# EAGLE design H01R01 (EAGLE 9.6.2)

## Sheet 1 of 2
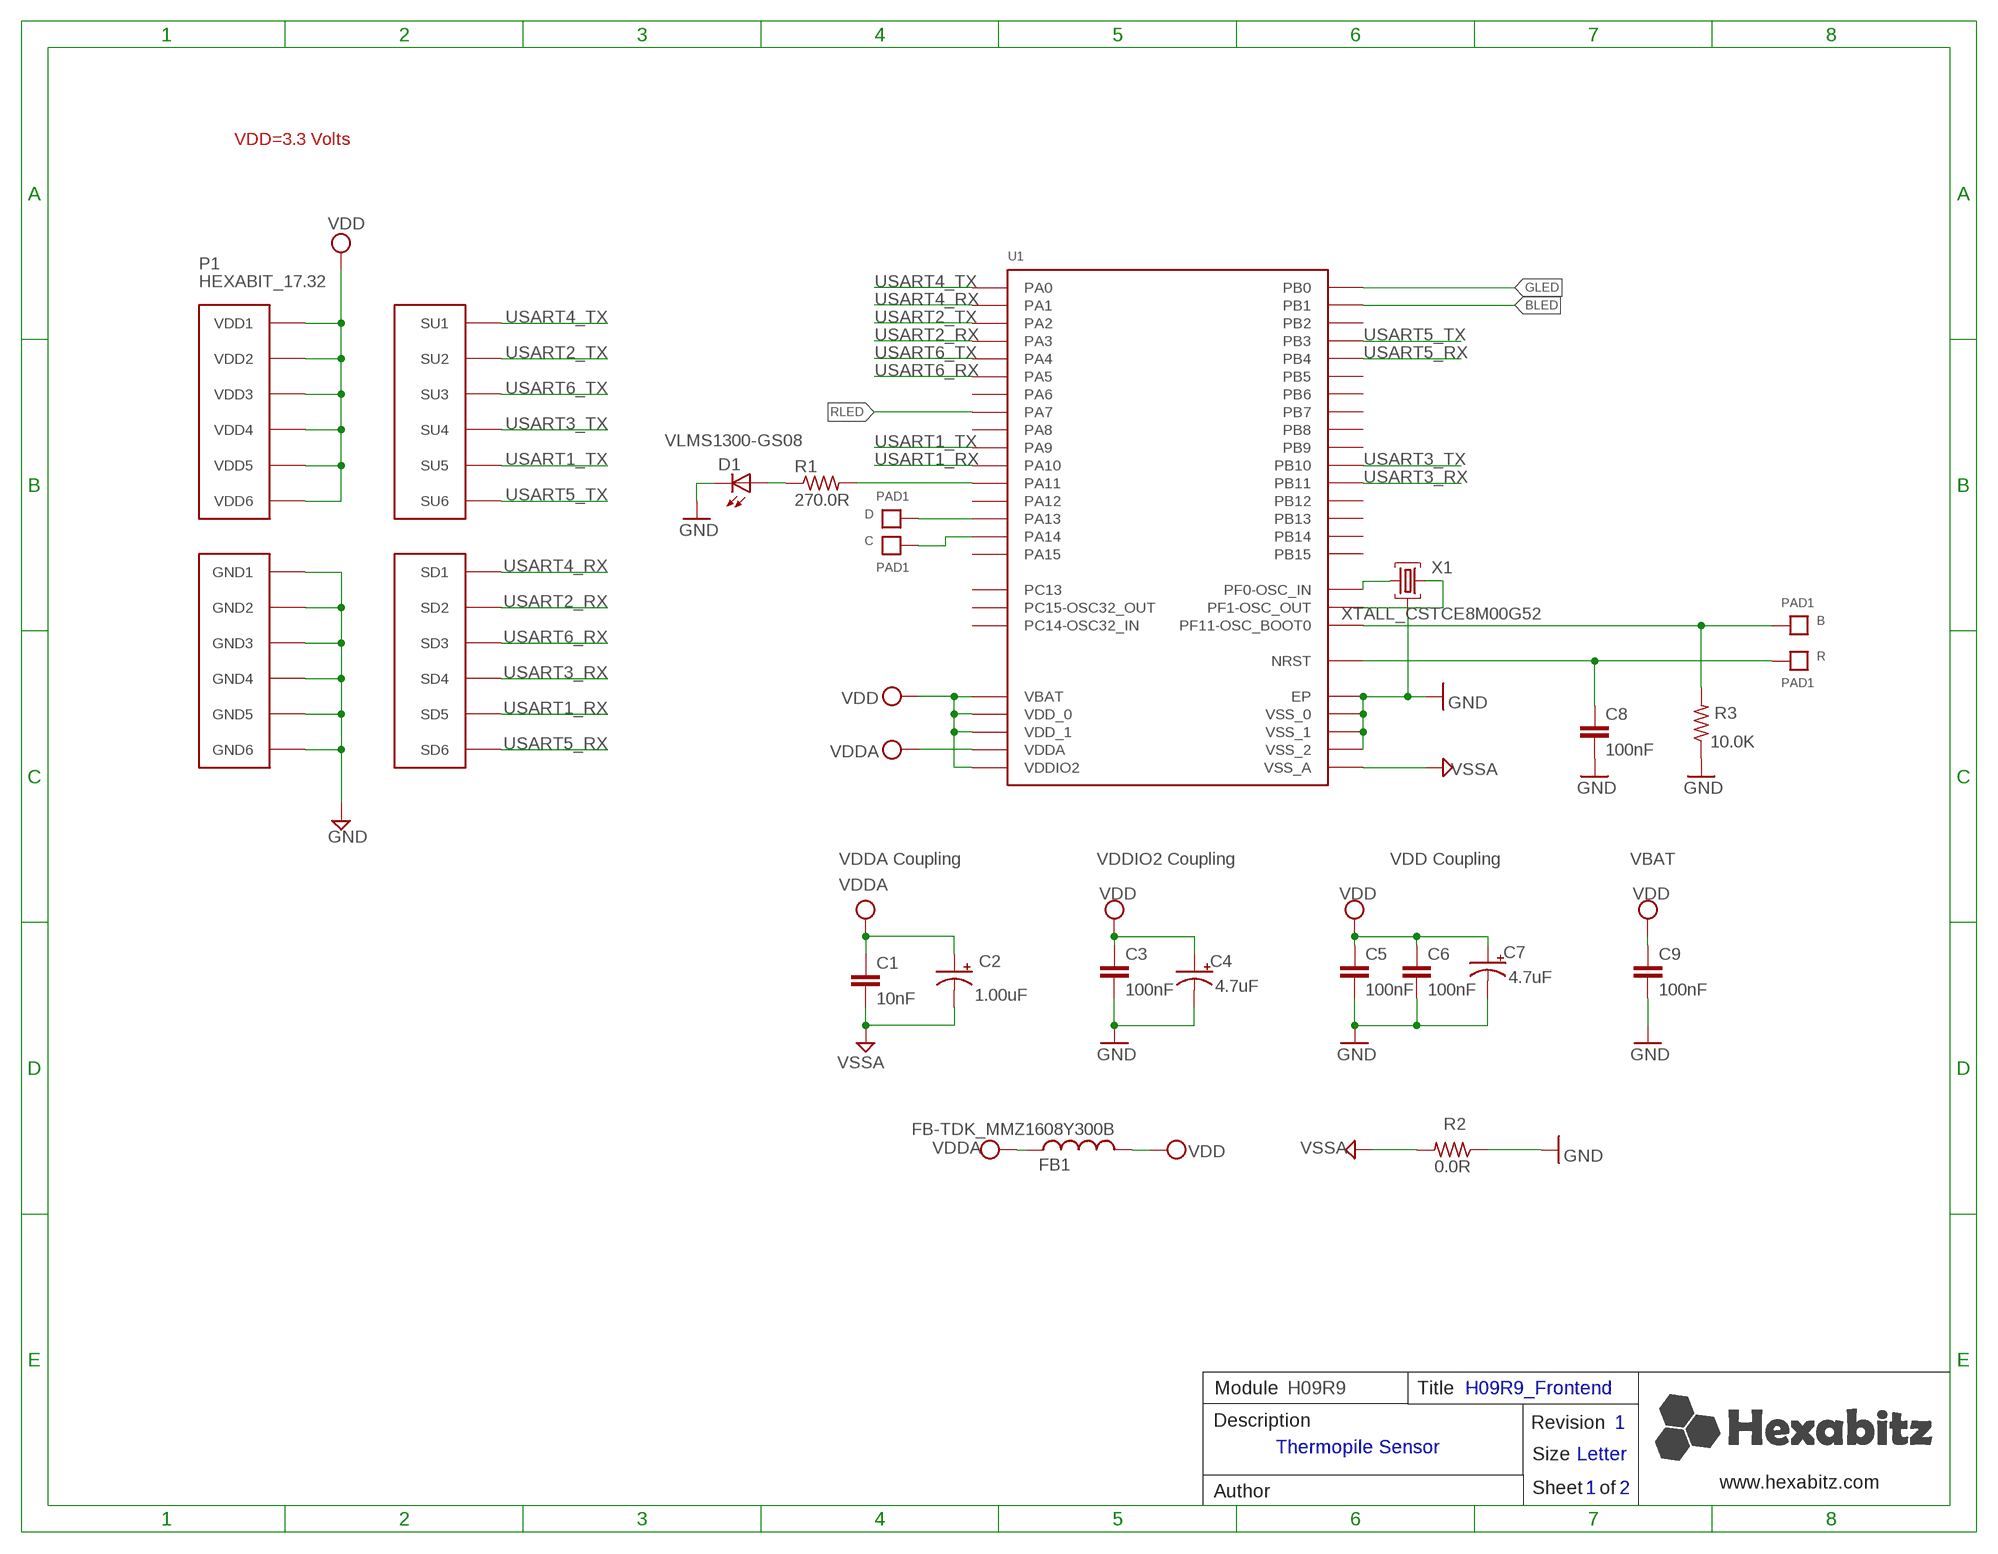
[diagram p0: schematic, sheet 1]

### Parts
B  PAD1  [PAD1]
C  PAD1  [PAD1]
C1  10nF  C-0603  [C-0603]
C2  1.00uF  C-0805-POL  [C-0805-POL]
C3  100nF  C-0603  [C-0603]
C4  4.7uF  C-0805-POL  [C-0805-POL]
C5  100nF  C-0603  [C-0603]
C6  100nF  C-0603  [C-0603]
C7  4.7uF  C-0805-POL  [C-0805-POL]
C8  100nF  C-0603  [C-0603]
C9  100nF  C-0603  [C-0603]
D  PAD1  [PAD1]
D1  VLMS1300-GS08  [VLMS1300-GS08]
FB1  FB-TDK_MMZ1608Y300B  [FB-TDK_MMZ1608Y300B]
P1  HEXABIT_17.32  [HEXABIT_17.32]
R  PAD1  [PAD1]
R1  270.0R  R-0603  [R-0603]
R2  0.0R  R-0603  [R-0603]
R3  10.0K  R-0603  [R-0603]
U1  STM32F091CBU6  [STM32F091CBU6]
X1  XTALL_CSTCE8M00G52  [XTALL_CSTCE8M00G52]

### Nets
B1: B.P$1 B.P$2 R3.2 U1.P$44(PF11-OSC_BOOT0)
BLED: U1.P$19(PB1)
GLED: U1.P$18(PB0)
GND: C3.2 C4.2(-) C5.2 C6.2 C7.2(-) C8.2 C9.2 D1.C P1.PAD_PD7(GND1) P1.PAD_PD8(GND2) P1.PAD_PD9(GND3) P1.PAD_PD10(GND4) P1.PAD_PD11(GND5) P1.PAD_PD12(GND6) R2.1 R3.1 U1.EP U1.P$23(VSS_0) U1.P$35(VSS_1) U1.P$47(VSS_2) X1.P$2 ; also sheet 2
N$3: R1.2 U1.P$32(PA11)
N$4: D1.A R1.1
N$5: U1.P$5(PF0-OSC_IN) X1.P$1
N$6: U1.P$6(PF1-OSC_OUT) X1.P$3
N$7: D.P$1 D.P$2 U1.P$34(PA13)
N$9: C.P$1 C.P$2 U1.P$37(PA14)
R1: C8.1 R.P$1 R.P$2 U1.P$7(NRST)
RLED: U1.P$17(PA7)
USART1_RX: P1.PAD_PD5(SD5) U1.P$31(PA10)
USART1_TX: P1.PAD_PU5(SU5) U1.P$30(PA9)
USART2_RX: P1.PAD_PD2(SD2) U1.P$13(PA3)
USART2_TX: P1.PAD_PU2(SU2) U1.P$12(PA2)
USART3_RX: P1.PAD_PD4(SD4) U1.P$22(PB11)
USART3_TX: P1.PAD_PU4(SU4) U1.P$21(PB10)
USART4_RX: P1.PAD_PD1(SD1) U1.P$11(PA1)
USART4_TX: P1.PAD_PU1(SU1) U1.P$10(PA0)
USART5_RX: P1.PAD_PD6(SD6) U1.P$40(PB4)
USART5_TX: P1.PAD_PU6(SU6) U1.P$39(PB3)
USART6_RX: P1.PAD_PD3(SD3) U1.P$15(PA5)
USART6_TX: P1.PAD_PU3(SU3) U1.P$14(PA4)
VDD: C3.1 C4.1(+) C5.1 C6.1 C7.1(+) C9.1 FB1.2 P1.PAD_PU7(VDD1) P1.PAD_PU8(VDD2) P1.PAD_PU9(VDD3) P1.PAD_PU10(VDD4) P1.PAD_PU11(VDD5) P1.PAD_PU12(VDD6) U1.P$1(VBAT) U1.P$24(VDD_0) U1.P$36(VDDIO2) U1.P$48(VDD_1)
VDDA: C1.1 C2.1(+) FB1.1 U1.P$9(VDDA)
VSSA: C1.2 C2.2(-) R2.2 U1.P$8(VSS_A)
Unconnected: U1.P$2(PC13) U1.P$3(PC14-OSC32_IN) U1.P$4(PC15-OSC32_OUT) U1.P$16(PA6) U1.P$20(PB2) U1.P$25(PB12) U1.P$26(PB13) U1.P$27(PB14) U1.P$28(PB15) U1.P$29(PA8) U1.P$33(PA12) U1.P$38(PA15) U1.P$41(PB5) U1.P$42(PB6) U1.P$43(PB7) U1.P$45(PB8) U1.P$46(PB9)

### Notes on the sheet
- VDD=3.3 Volts
- VDDA Coupling | VDDIO2 Coupling | VDD Coupling | VBAT
- Module | H09R9 | Title | H09R9_Frontend
- Description | Revision | 1
- Thermopile Sensor
- Size | Letter
- www.hexabitz.com
- Author | Sheet   of | 1 | 2
- C:/Users/Admin/Desktop/logodraft.bmp

## Sheet 2 of 2
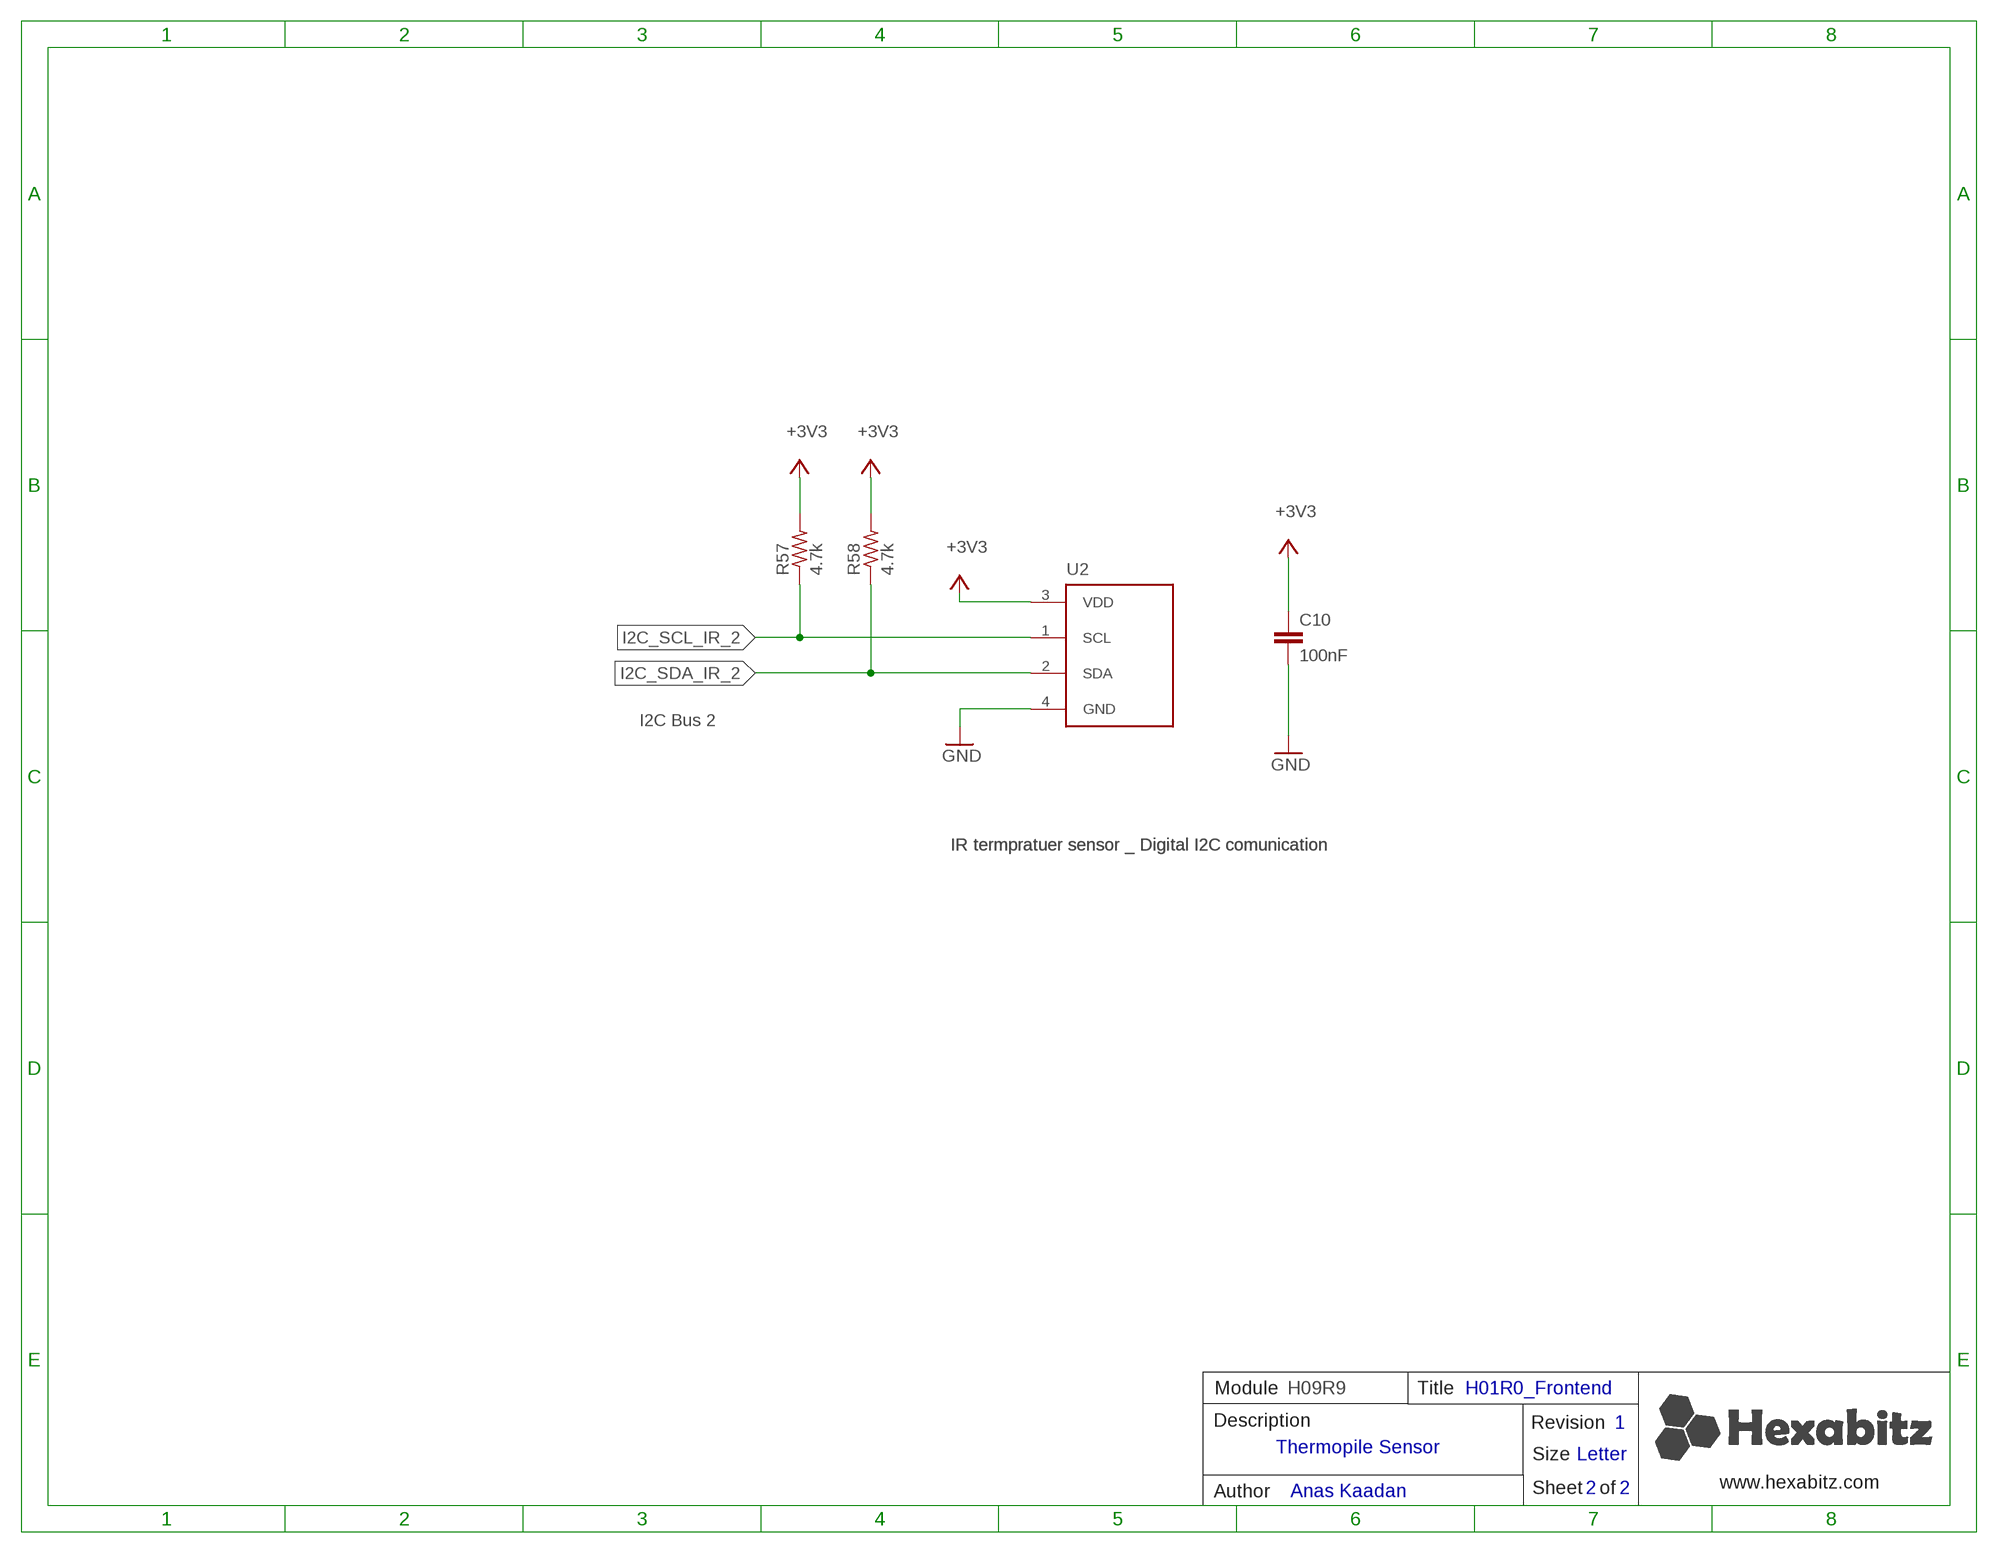
[diagram p1: schematic, sheet 2]

### Parts
C10  100nF  C-0603  [C-0603]
R57  4.7k  R-0603  [R-0603]
R58  4.7k  R-0603  [R-0603]
U2  TSD305-1C55  [TEMPERATURESENSOR-TO5]

### Nets
+3V3: C10.1 R57.2 R58.2 U2.3(VDD)
GND: C10.2 U2.4(GND) ; also sheet 1
I2C_SCL_IR_2: R57.1 U2.1(SCL)
I2C_SDA_IR_2: R58.1 U2.2(SDA)

### Notes on the sheet
- I2C Bus 2
- IR termpratuer sensor _ Digital I2C comunication | IR termpratuer sensor _ Digital I2C comunication
- Module | H09R9 | Title | H01R0_Frontend
- Description | Revision | 1
- Thermopile Sensor
- Size | Letter
- www.hexabitz.com
- Author | Anas Kaadan | Sheet   of | 2 | 2

## Library data of the parts
B C D R = Hexabitz:PAD1
C1 = Hexabitz:C-0603: CAP CER 10% X7R 0603; CAPACITANCE: 10nF; MFN: KEMET; MPN: C0603C103K5RACTU; OCTOPART_URL: https://octopart.com/c0603c103k5ractu-kemet-133094?r=sp&s=R_iPBxLnSmGqhkU2rIMFpg; TOLERANCE: 10%; VOLTAGE_RATING: 50V
C2 = Hexabitz:C-0805-POL: Cap Tant Solid SMD 2012; CAPACITANCE: 1.00uF; MFN: Yageo; MPN: CC0805KKX7R7BB105; OCTOPART_URL: https://octopart.com/cc0805kkx7r7bb105-yageo-8376555?r=sp&s=YKl1wwtkROau_X5nniH2ig; TOLERANCE: 10%; VOLTAGE_RATING: 16V
C3 C6 C8 = Hexabitz:C-0603: CAP CER 10% X7R 0603; CAPACITANCE: 100nF; MFN: KEMET; MPN: C0603C104K8RACTU; OCTOPART_URL: https://octopart.com/c0603c104k8ractu-kemet-145075?r=sp&s=9bS9ASSwSEqMCE9KBEQZ0g; TOLERANCE: 10%; VOLTAGE_RATING: 10V
C4 C7 = Hexabitz:C-0805-POL: Cap Tant Solid SMD 2012; CAPACITANCE: 4.7uF; MFN: Murata; MPN: GRM21BC81E475KA12L; OCTOPART_URL: https://octopart.com/grm21bc81e475ka12l-murata-10331911?r=sp&s=RY3qZSD8T6mG6TC9CHI5qQ; TOLERANCE: 10%; VOLTAGE_RATING: 25V
C5 = Hexabitz:C-0603: CAP CER 10% X7R 0603; CAPACITANCE: 100nF; MFN: KEMET; MPN: C0603C104K8RACTU; OCTOPART_URL: https://octopart.com/c0603c104k8ractu-kemet-145075?r=sp&s=9bS9ASSwSEqMCE9KBEQZ0g; TOLERANCE: 10%; VOLTAGE_RATING: 10
C9 = Hexabitz:C-0603: CAP CER 10% X7R 0603; CAPACITANCE: 100nF; MFN: KEMET; MPN: C0603C104K8RACTU; OCTOPART_URL: https://octopart.com/c0603c104k8ractu-kemet-145075?r=sp&s=9bS9ASSwSEqMCE9KBEQZ0g; TOLERANCE: 10V; VOLTAGE_RATING: 10%
C10 = HEXABITZ_RCLS:C-0603: CAP CER 10% X7R 0603; CAPACITANCE: 100nF; MFN: KEMET; MPN: C0603C104K8RACTU; OCTOPART_URL: https://octopart.com/c0603c104k8ractu-kemet-145075?r=sp&s=9bS9ASSwSEqMCE9KBEQZ0g; TOLERANCE: 10%; VOLTAGE_RATING: 10V
D1 = Hexabitz:VLMS1300-GS08: Red 0603 130° Clear 54 mcd 2 V Surface Mount ChipLED ; Octopart Url : http://octopart.com/vlms1300-gs08-vishay-21709201; MFN: Vishay; MPN: VLMS1300-GS08; OCTOPART_URL: https://octopart.com/vlms1300-gs08-vishay-21709201?r=sp&s=_gcP4_q8T1SC6PJQPTQ9yA
FB1 = Hexabitz:FB-TDK_MMZ1608Y300B: Ferrite Beads Multi-Layer 30Ohm 25% 100MHz 1.5A 50mOhm DCR 0603; MFN: TDK; MPN: MMZ1608Y300B; OCTOPART_URL: https://octopart.com/mmz1608y300b-tdk-368280?r=sp&s=cd9_2ZEqQ9q9UNBuQgHAiA
P1 = hexabitz_connectors:HEXABIT_?: Hexabitz Hexagon Module Connector Hexagon side length = 17.32mm.
R1 = Hexabitz:R-0603: Thick Film Resistors - SMD 0603; MFN: Yageo; MPN: RC0603FR-07270RL; OCTOPART_URL: https://octopart.com/search?q=RC0603FR-07270RL&start=0; RESISTANCE: 270.0 Ohm; TOLERANCE: 5%
R2 = Hexabitz:R-0603: Thick Film Resistors - SMD 0603; MFN: Yageo; MPN: RC0603JR-070RL; OCTOPART_URL: https://octopart.com/rc0603jr-070rl-yageo-1241539?r=sp&s=X2NteqRjRNWrnx42Y0aliA; RESISTANCE: 0.0 Ohm
R3 = Hexabitz:R-0603: Thick Film Resistors - SMD 0603; MFN: Yageo; MPN: RC0603JR-0710KL; OCTOPART_URL: https://octopart.com/search?q=RC0603JR-0710KL&start=0; RESISTANCE: 10.0K Ohm; TOLERANCE: 5%
R57 R58 = HEXABITZ_RCLS:R-0603: Thick Film Resistors - SMD 0603; MFN: Yageo; MPN: RC0603FR-07270RL; OCTOPART_URL: https://octopart.com/crcw06032k20fkea-vishay-40018987; RESISTANCE: 2.2 kΩ; TOLERANCE: ±1%
U1 = Hexabitz:STM32F091CBU6: Description : ARM-based 32-bit MCU, CAN, 12 timers, ADC, DAC & Comm. Interface, 2 to 3.6 V, -40 to 85 degC, 48-Pin UFQFPN, RoHS, Tray ;Parameter : Ciiva URL : https://ciiva.com/part/STM32F091CBU6-20240708, CiivaID : 20240708, Clock Speed : 48000000.0 Hz, Lifecycle Status : Active, Mounting Style : Surface Mount, Number of Pins : 48, Octopart Url : https://octopart.com/stm32f091cbu6-stmicroelectronics-51988677, OctopartID : 5f4f955c32ec8088, RAM Memory Size : 32768 B, REACH SVHC Compliance : No SVHC, RoHS : Compliant,; MFN: STMicroelectronics; MPN: STM32F091CBU6; OCTOPART_URL: https://octopart.com/stm32f091cbu6-stmicroelectronics-51988677?r=sp&s=bU6fpgsrTZOxHyt7jkfh3w
U2 = HEXABITZ_ICs:TSD305-1C55: I2C DIGITAL THERMOPILE SENSOR; MFN: TE Connectivity; MPN: G-TPMO-101; OCTOPART_URL: https://octopart.com/g-tpmo-101-te+connectivity-76900424?r=sp
X1 = Hexabitz:XTALL_CSTCE8M00G52: MURATA CSTCE8M00G52-R0 RESONATOR, SMD, 8MHZ ; Octopart Url : https://octopart.com/cstce8m00g52-r0-murata-7145559; MFN: Murata; MPN: CSTCE8M00G52Z-R0; OCTOPART_URL: https://octopart.com/cstce8m00g52z-r0-murata-17755941?r=sp&s=JDnNJnrHQhyS8Zk4ofFWXw

## Board
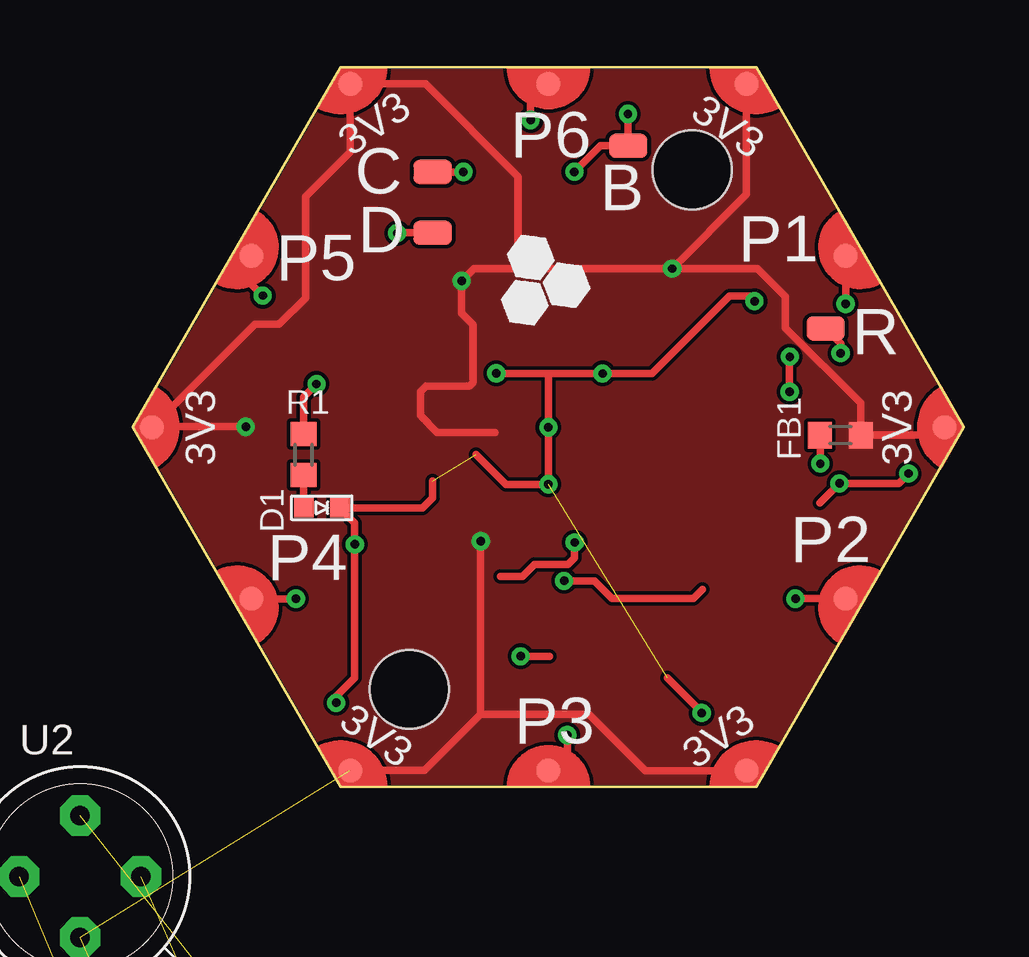
[diagram p2: board, top side]
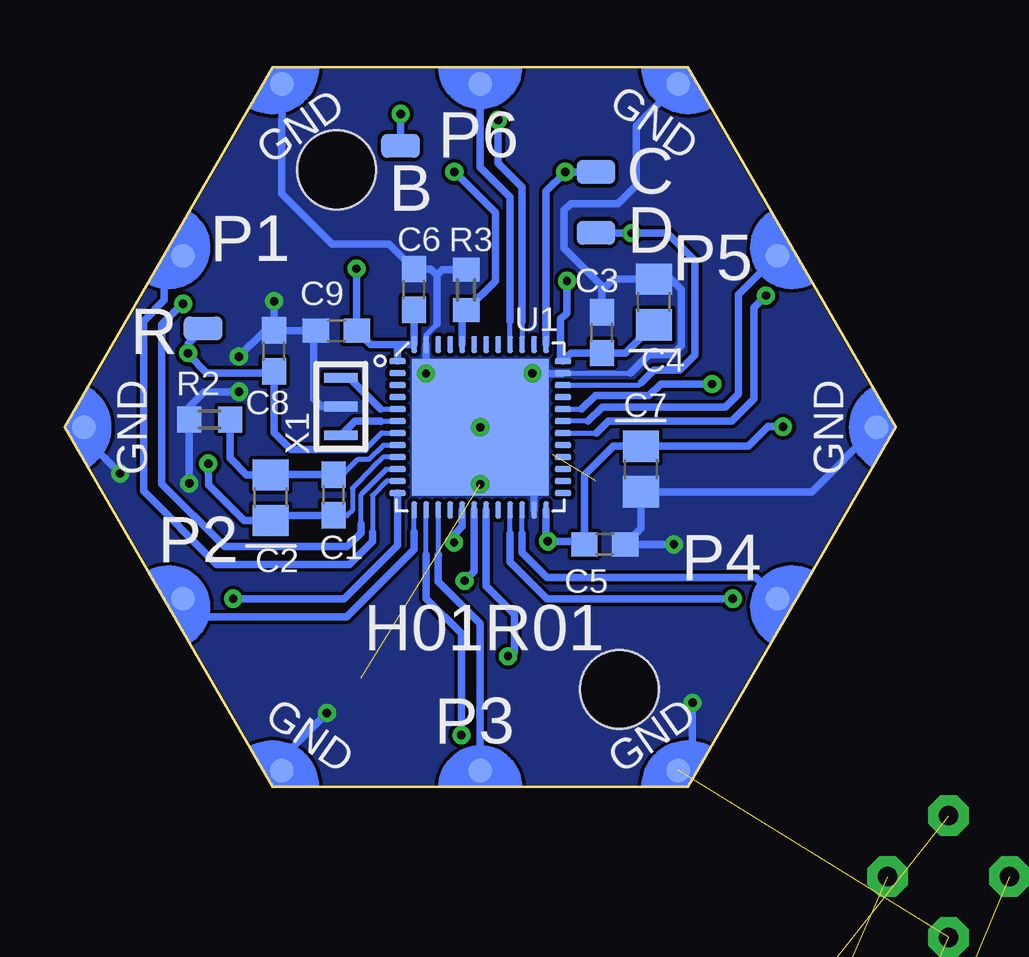
[diagram p3: board, bottom side, seen from below]

Size 34.64 x 30 mm. Coordinates in mm from the lower left corner, seen from the top.
Copper layers (1*16): Top 0.035mm / dielectric 1.5mm / Bottom 0.035mm
Design rules "2_layer *": minimum track width 7mil, minimum drill 10mil, track to track 6mil, track to pad 6mil, pad to pad 6mil, via to via 6mil, smd to smd 0mil, copper to edge 1mil, drill to drill 8mil, minimum pad ring 10mil, minimum via ring 8mil, stop-mask expansion 2mil, vias tented up to drill 15mil, thermal gap 10mil
Holes 3.28 mm at 11.52,4.07 23.31,25.73

### Footprints (pad centres in the part's own frame; a part is rotated, then mirrored left to right if it is on the bottom)
PAD1 = smd 1.6 x 1: P$1 0,0 | smd 1.6 x 1 bottom: P$2 0,0
C-0603 = smd 1.1 x 1: 1 -0.85,0; 2 0.85,0
C-0805-POL = smd 1.3 x 1.5: 1 -0.95,0; 2 0.95,0
VLMS1300-GS08 = smd 0.8 x 0.8: A 0,0.75; C 0,-0.75
FB-TDK_MMZ1608Y300B = smd 1 x 1.1: 1 -0.85,0; 2 0.85,0
HEXABIT_17.32 = smd 1 x 1 bottom: PAD_PD1 12.39,7.15; PAD_PD2 12.39,-7.15; PAD_PD3 0,-14.31; PAD_PD4 -12.39,-7.15; PAD_PD5 -12.39,7.15; PAD_PD6 0,14.31; PAD_PD7 8.26,14.31; PAD_PD8 16.52,0; PAD_PD9 8.26,-14.31; PAD_PD10 -8.26,-14.31; PAD_PD11 -16.52,0; PAD_PD12 -8.26,14.31 | smd 1 x 1: PAD_PU1 12.39,7.15; PAD_PU2 12.39,-7.15; PAD_PU3 0,-14.31; PAD_PU4 -12.39,-7.15; PAD_PU5 -12.39,7.15; PAD_PU6 0,14.31; PAD_PU7 8.26,14.31; PAD_PU8 16.52,0; PAD_PU9 8.26,-14.31; PAD_PU10 -8.26,-14.31; PAD_PU11 -16.52,0; PAD_PU12 -8.26,14.31
R-0603 = smd 1 x 1.1: 1 -0.85,0; 2 0.85,0
STM32F091CBU6 = smd 5.7 x 5.7: EP 0,0 | smd 0.25 x 0.7: P$1 -2.75,-3.45; P$2 -2.25,-3.45; P$3 -1.75,-3.45; P$4 -1.25,-3.45; P$5 -0.75,-3.45; P$6 -0.25,-3.45; P$7 0.25,-3.45; P$8 0.75,-3.45; P$9 1.25,-3.45; P$10 1.75,-3.45; P$11 2.25,-3.45; P$12 2.75,-3.45; P$25 2.75,3.45; P$26 2.25,3.45; P$27 1.75,3.45; P$28 1.25,3.45; P$29 0.75,3.45; P$30 0.25,3.45; P$31 -0.25,3.45; P$32 -0.75,3.45; P$33 -1.25,3.45; P$34 -1.75,3.45; P$35 -2.25,3.45; P$36 -2.75,3.45 | smd 0.7 x 0.25: P$13 3.45,-2.75; P$14 3.45,-2.25; P$15 3.45,-1.75; P$16 3.45,-1.25; P$17 3.45,-0.75; P$18 3.45,-0.25; P$19 3.45,0.25; P$20 3.45,0.75; P$21 3.45,1.25; P$22 3.45,1.75; P$23 3.45,2.25; P$24 3.45,2.75; P$37 -3.45,2.75; P$38 -3.45,2.25; P$39 -3.45,1.75; P$40 -3.45,1.25; P$41 -3.45,0.75; P$42 -3.45,0.25; P$43 -3.45,-0.25; P$44 -3.45,-0.75; P$45 -3.45,-1.25; P$46 -3.45,-1.75; P$47 -3.45,-2.25; P$48 -3.45,-2.75
TEMPERATURESENSOR-TO5 = drill 0.813 pad 1.676 octagon: 1 2.54,0; 2 0,2.54; 3 -2.54,0; 4 0,-2.54
XTALL_CSTCE8M00G52 = smd 1.4 x 0.4: P$1 0,1.2; P$2 0,0; P$3 0,-1.2

### Placement (x,y rotation side)
B  20.65,26.73 0 top
C  12.49,25.64 0 top
C1  23.43,12.17 90 bottom
C2  26.06,12.06 90 bottom
C3  12.25,18.94 90 bottom
C4  10.09,20.22 90 bottom
C5  12.12,10.12 0 bottom
C6  20.09,20.74 90 bottom
C7  10.62,13.26 270 bottom
C8  25.91,18.18 90 bottom
C9  23.32,19.03 180 bottom
C10  1.45,-16.55 0 top  (outside the outline)
D  12.49,23.1 180 top
D1  7.87,11.64 90 top
FB1  29.49,14.67 0 top
P1  17.32,15 0 top
R  28.88,19.11 0 top
R1  7.11,13.86 90 top
R2  28.6,15.32 0 bottom
R3  17.91,20.73 270 bottom
R57  6.79,-16.55 0 top  (outside the outline)
R58  10.75,-16.55 0 top  (outside the outline)
U1  17.32,15 270 bottom
U2  -2.2,-3.73 0 top
X1  23.13,15.86 0 bottom

### Tracks (layer width: path | path; a pad name or v marks a point on that pad's centre or on a via)
+3V3  (3 unrouted)
B1  (via drill 0.35)
  Top 0.305: v20.63,28.06 20.63,26.75 | 20.63,26.75 B.P$1 | v18.4,25.65 19.5,26.75 20.63,26.75
  Bottom 0.305: B.P$1 20.65,28.04 v20.63,28.05 v20.63,28.06 | v18.4,25.65 16.69,23.94 16.69,21.09 R3.2 18.07,19.72 U1.P$44
BLED  (via drill 0.35)
  Top 0.305: v16.16,5.45 17.36,5.45
  Bottom 0.305: U1.P$19 17.07,8.38 15.89,7.2 15.89,5.61 16.05,5.45 v16.16,5.45
GLED  (via drill 0.35)
  Top 0.305: 23.74,8.23 23.37,7.86 19.97,7.86 19.23,8.6 19.23,8.59 v17.97,8.59
  Bottom 0.305: U1.P$18 17.57,8.99 v17.97,8.6 v17.97,8.59
GND  (via drill 0.35)  (4 unrouted)
  Top 0.305: 12.49,12.76 12.49,12.05 12.08,11.64 D1.C 9.25,11.02 v9.25,10.12 9.25,4.55 8.47,3.78 v8.47,3.51 | 17.32,17.25 U1.EP 17.32,12.68 17.33,12.68 v17.33,12.62 | 17.32,17.25 v15.14,17.25 | 17.32,17.25 19.56,17.25 | 19.56,17.25 | 19.56,17.25 v19.58,17.25 v19.58,17.24 21.64,17.24 24.86,20.46 25.71,20.46 v25.91,20.25 | v17.33,12.62 v17.32,12.62 | 14.3,13.87 15.55,12.61 v17.33,12.61 v17.33,12.62 | v27.37,16.48 v27.37,17.93 v27.38,17.94 | 28.64,11.84 v29.45,12.66 31.92,12.66 v32.33,13.07 | v32.33,13.07 | v23.71,3.09 23.71,3.12 22.28,4.55
  Bottom 0.203: U1.P$47 19.57,18.85 19.13,19.29 | U1.P$35 11.06,17.25 | C4.2 | 12.26,20.67 12.25,20.66
  Bottom 0.305: 19.13,19.29 19.13,21.34 | P1.PAD_PD7 25.58,27.82 25.59,27.81 25.59,24.73 23.49,22.63 21.13,22.63 C6.2 19.38,21.59 19.13,21.34 | U1.P$35 17.32,17.25 17.32,17.24 | 17.32,17.24 U1.EP v17.32,12.62 15.07,12.62 U1.P$23 | v19.57,17.24 17.32,17.24 | U1.P$47 v19.57,17.24 | v19.57,17.24 v19.58,17.24 | v27.37,16.48 v27.37,16.47 27.39,16.46 28.83,16.46 29.45,15.84 R2.1 29.45,12.69 29.44,12.69 v29.44,12.67 v29.45,12.66 | 11.06,17.25 10.28,18.03 9.31,18.03 8.93,18.4 8.93,20.74 9.36,21.16 C4.2 | C4.2 11.76,21.17 12.26,20.67 | 12.25,20.66 C3.2 12.25,20.89 13.82,22.47 13.82,24.04 13.53,24.33 11.58,24.33 10.81,25.1 10.81,27.56 P1.PAD_PD12 | P1.PAD_PD9 25.58,1.21 v23.71,3.09 | R3.1 18.89,21.58 19.13,21.34 | P1.PAD_PD11 3.49,12.31 C7.2 10.62,10.77 C5.2 v9.25,10.12 | X1.P$2 23.93,15.86 24.26,16.19 24.26,18.93 C9.2 C8.2 | C8.2 v25.91,20.25 | v27.38,17.94 26.3,19.03 C8.2 | v32.33,13.07 33.84,14.57 P1.PAD_PD8 | v8.47,3.51 8.47,1.28 P1.PAD_PD10
  other vias: 17.32,15
  pour Bottom (no thermals): 8.66,0 25.98,0 34.64,15 25.98,30 8.66,30 0,15
I2C_SCL_IR_2  (1 unrouted)
I2C_SDA_IR_2  (1 unrouted)
N$3  (via drill 0.35)
  Top 0.305: v7.65,16.8 7.11,16.26 R1.2
  Bottom 0.203: U1.P$32 13.09,15.75
  Bottom 0.305: 13.09,15.75 12.52,16.31 10.28,16.31 9.79,16.8 v7.66,16.8 v7.65,16.8
N$4
  Top 0.305: R1.1 D1.A
N$5
  Bottom 0.203: 21.47,15.75 U1.P$5
  Bottom 0.305: X1.P$1 22.78,17.06 21.47,15.75
N$6
  Bottom 0.203: 21.47,15.24 21.46,15.25 U1.P$6
  Bottom 0.305: X1.P$3 22.54,15.25 21.48,15.25 21.47,15.24
N$7  (via drill 0.35)
  Top 0.305: D.P$1 11.03,23.1 v11.02,23.09
  Bottom 0.203: U1.P$34 10.71,16.75 10.6,16.86
  Bottom 0.305: 10.6,16.86 10.07,17.39 8.99,17.39 8.36,18.01 8.36,21.94 9.52,23.09 v11.02,23.09 D.P$1
N$9  (via drill 0.35)
  Top 0.305: C.P$1 v13.77,25.64 v13.78,25.64
  Bottom 0.305: U1.P$37 14.57,24.85 v13.78,25.64 C.P$1
R1  (via drill 0.35)
  Top 0.305: v29.5,18.09 29.5,18.49 R.P$1
  Bottom 0.203: U1.P$7 21.43,14.76 22.11,14.07
  Bottom 0.305: 22.11,14.07 25.21,14.07 25.91,14.77 C8.1 25.99,17.25 28.72,17.25 29.5,18.04 v29.5,18.09 29.5,18.49 R.P$1
RLED  (via drill 0.35)
  Top 0.305: 15.33,8.79 16.24,8.79 16.74,9.29 18.14,9.29 18.41,9.56 18.41,10.12 | 18.41,10.12 | 18.41,10.12 v18.41,10.19
  Bottom 0.305: v18.41,10.19 18.41,10.51 18.07,10.86 U1.P$17 | U1.P$17
USART1_RX
  Bottom 0.203: 12.83,15.25 U1.P$31
  Bottom 0.305: P1.PAD_PD5 6.55,20.53 6.55,16.39 7.09,15.85 12.23,15.85 12.83,15.25
USART1_TX  (via drill 0.35)
  Top 0.305: v5.41,20.48 4.93,20.96 P1.PAD_PU5
  Bottom 0.203: U1.P$30 12.47,14.75
  Bottom 0.305: 12.47,14.75 11.97,15.25 6.83,15.25 5.9,16.18 5.9,19.98 v5.4,20.48 v5.4,20.49 v5.41,20.49 v5.41,20.48
USART2_RX
  Bottom 0.203: 20.07,10.63 20.07,10.64 U1.P$13
  Bottom 0.305: P1.PAD_PD2 28.95,7.09 22.89,7.09 20.07,9.91 20.07,10.63
USART2_TX  (via drill 0.35)
  Top 0.305: v27.62,7.85 P1.PAD_PU2
  Bottom 0.305: U1.P$12 20.77,10.07 22.99,7.85 v27.62,7.85
USART3_RX
  Bottom 0.203: 15.57,10.56 U1.P$22 | U1.P$22
  Bottom 0.305: P1.PAD_PD4 5.83,8.74 14.53,8.74 15.57,9.78 15.57,10.56
USART3_TX  (via drill 0.35)
  Top 0.305: v6.79,7.85 P1.PAD_PU4 | P1.PAD_PU4
  Bottom 0.203: 16.07,10.57 U1.P$21
  Bottom 0.305: 16.07,10.57 16.08,10.56 16.08,9.38 14.55,7.85 v6.79,7.85
USART4_RX
  Bottom 0.203: U1.P$11 21.23,12.75 21.82,12.16 21.82,10.61
  Bottom 0.305: P1.PAD_PD1 30.49,21.37 30.49,20.3 31.36,19.43 31.36,12.34 28.3,9.28 22.77,9.28 21.82,10.24 21.82,10.61
USART4_TX  (via drill 0.35)
  Top 0.305: P1.PAD_PU1 29.62,22.06 29.71,21.97 v29.71,20.15
  Bottom 0.203: U1.P$10 21.23,13.25 22.29,12.19 22.29,10.96
  Bottom 0.305: v29.71,20.15 29.73,20.15 30.6,19.27 30.6,12.64 27.98,10.03 27.98,10.02 22.86,10.02 22.29,10.6 22.29,10.96
USART5_RX
  Bottom 0.203: 16.07,19.43 U1.P$40
  Bottom 0.305: 16.07,19.43 16.07,19.72 16.07,24.59 17.32,25.84 P1.PAD_PD6
USART5_TX  (via drill 0.35)
  Top 0.305: v16.58,27.81 16.58,28.57 P1.PAD_PU6
  Bottom 0.203: 15.58,19.41 U1.P$39
  Bottom 0.305: 15.58,19.41 15.57,19.42 15.57,25.01 16.58,26.02 v16.58,27.81
USART6_RX
  Bottom 0.203: 19.07,9.68 U1.P$15
  Bottom 0.305: P1.PAD_PD3 17.32,6.81 19.07,8.56 19.07,9.67 19.07,9.68
USART6_TX  (via drill 0.35)
  Top 0.305: v18.11,2.16 18.11,1.48 P1.PAD_PU3
  Bottom 0.203: 19.57,9.68 U1.P$14
  Bottom 0.305: 19.57,9.68 19.57,7.87 18.11,6.4 18.11,2.18 v18.11,2.16
VDD  (via drill 0.35)
  Top 0.305: 16.05,21.61 16.05,25.45 12.2,29.31 P1.PAD_PU12 9.06,26.47 7.2,24.61 7.2,20.39 6.1,19.29 5.09,19.29 P1.PAD_PU11 0.91,15.11 0.99,15.02 v4.7,15.02 | 15.09,14.78 12.69,14.78 11.98,15.48 11.98,16.48 12.22,16.72 14.03,16.72 14.18,16.87 14.18,19.28 13.7,19.75 v13.7,21.1 14.22,21.61 16.05,21.61 | v14.5,10.24 v14.49,10.24 14.49,3.03 | 16.05,21.61 22.46,21.61 v22.48,21.61 | v22.48,21.61 25.58,24.71 P1.PAD_PU7 | v22.48,21.61 26.02,21.61 27.2,20.43 27.2,19.14 30.34,16 FB1.2 33.51,14.67 P1.PAD_PU8 | P1.PAD_PU9 25.57,0.68 21.36,0.68 19.02,3.02 14.5,3.02 14.49,3.03 | 14.49,3.03 12.16,0.69 P1.PAD_PU10
  Bottom 0.203: 20.09,18.47 U1.P$48
  Bottom 0.305: C4.1 11.26,18.09 C3.1 13.53,18.09 U1.P$36 13.97,17.85 13.97,19.5 13.7,19.76 v13.7,21.1 | C6.1 20.09,18.47 | U1.P$24 14.57,10.31 v14.5,10.24 13.1,10.24 C5.1 12.97,13 11.76,14.21 C7.1 6.13,14.21 5.32,15.02 v4.7,15.02 | v22.48,21.61 22.48,19.04 C9.1 21.89,18.45 20.77,18.45 | U1.P$1 20.77,18.45 | 20.77,18.45 U1.P$48
  pour Top (no thermals): 8.66,0 25.98,0 34.64,15 25.98,30 8.66,30 0,15
VDDA  (via drill 0.35)
  Top 0.305: v28.66,13.48 FB1.1
  Bottom 0.203: U1.P$9 21.36,13.75 21.8,13.31 22.65,12.46 22.65,11.53 22.86,11.32 22.87,11.32 C1.1
  Bottom 0.305: v28.66,13.48 28.65,12.59 27.17,11.11 C2.1 25.85,11.32 C1.1
VSSA
  Bottom 0.203: U1.P$8 21.36,14.25 21.94,13.67 22.41,13.67 23.05,13.02
  Bottom 0.305: R2.2 27.75,13.71 27.05,13.01 C2.2 26.05,13.02 C1.2 23.05,13.02

### Text on the board
tPlace: 3V3 | P6 | 3V3 | P5 | P1 | 3V3 | 3V3 | P2 | P4 | 3V3 | P3 | 3V3
bPlace: GND | P6 | GND | P1 | P5 | GND | GND | P2 | P4 | H01R01 | GND | P3 | GND
bNames: C | B | D | R